# EAGLE design shield (EAGLE 7.6.0)

## Sheet 1 of 2
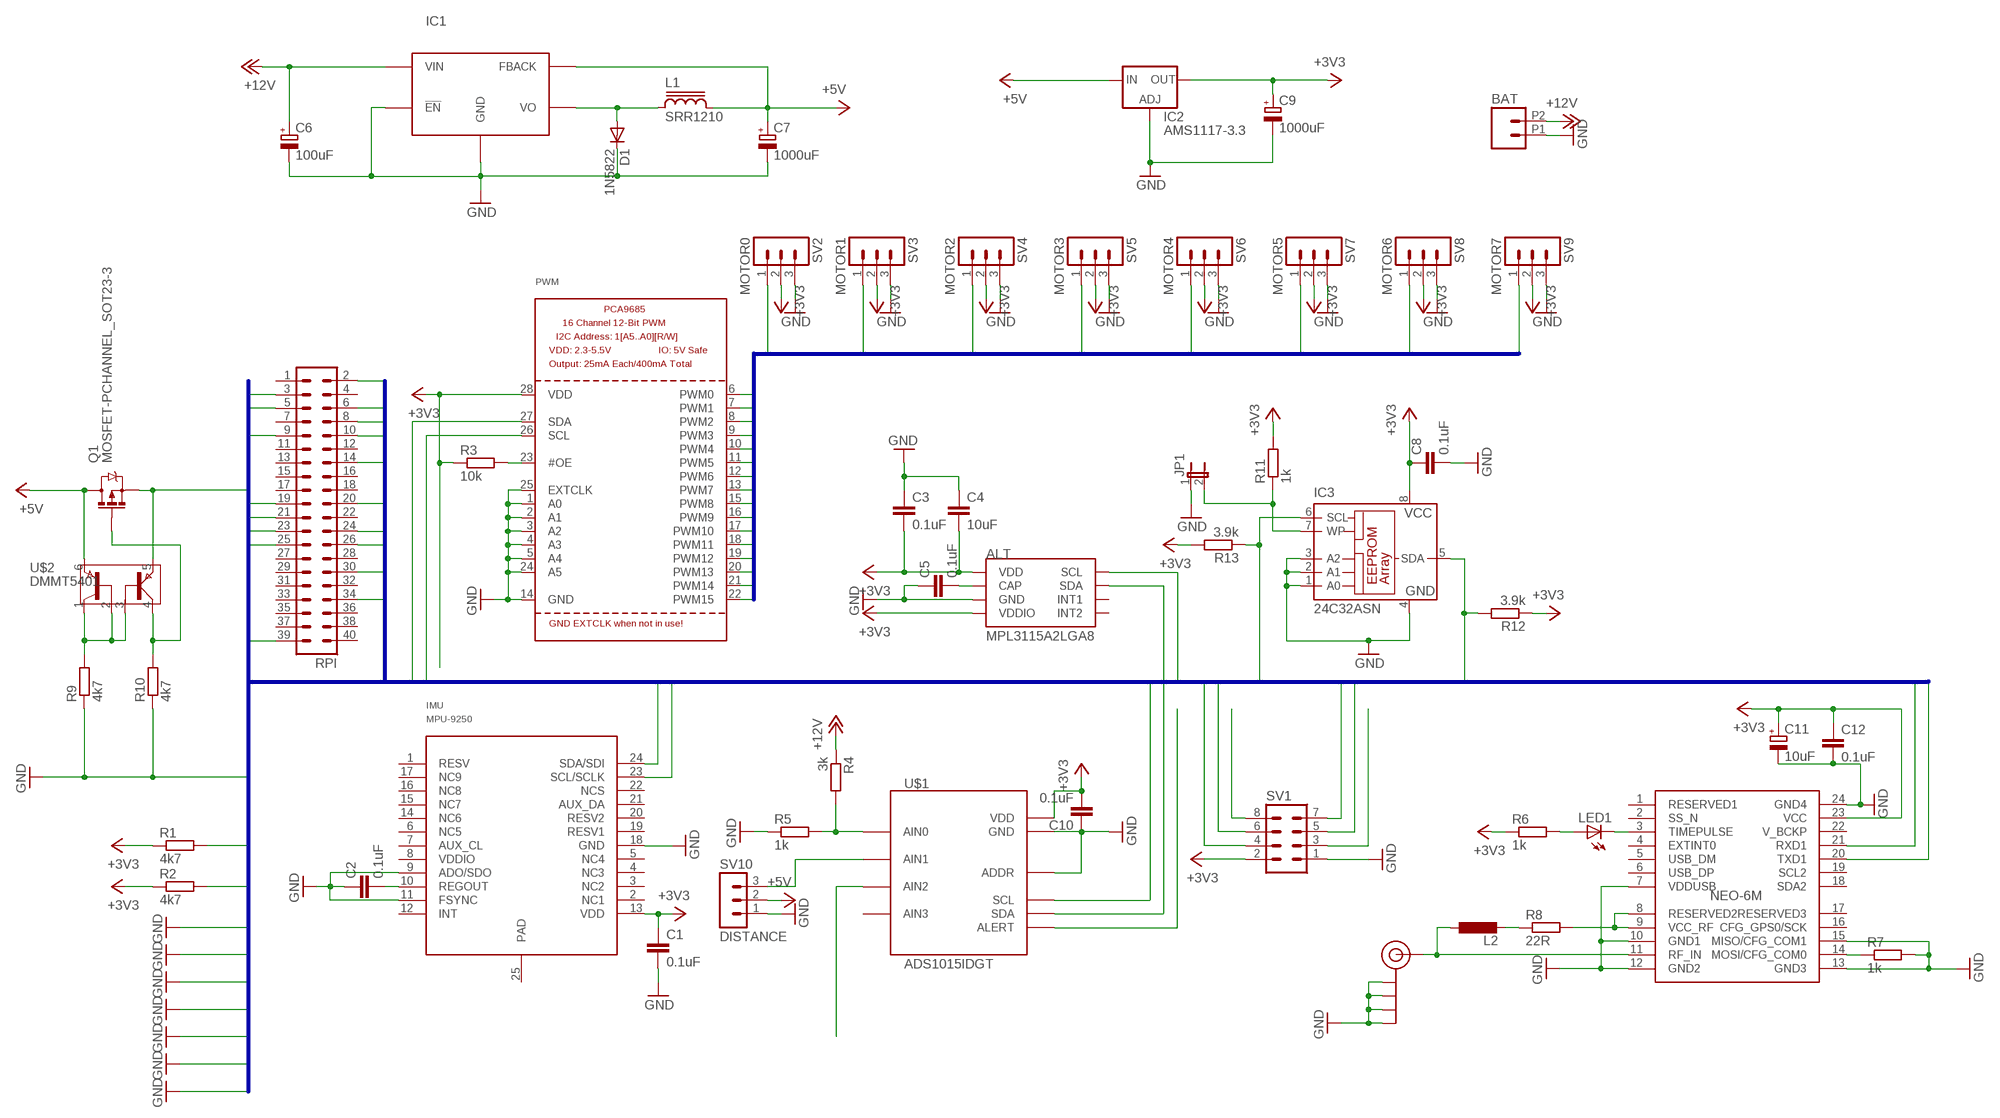
[diagram p0: schematic, sheet 1]

### Parts
ALT  MPL3115A2LGA8  [LGA8]
BAT  M022.54MM_SCREWTERM  [1X02_2.54_SCREWTERM]
C1  0.1uF  C-EUC1206  [C1206]
C2  0.1uF  C-EUC1206  [C1206]
C3  0.1uF  C-EUC1206  [C1206]
C4  10uF  C-EUC1206  [C1206]
C5  0.1uF  C-EUC1206  [C1206]
C6  100uF  CPOL-EU153CLV-0605  [153CLV-0605]
C7  1000uF  CPOL-EU153CLV-1012  [153CLV-1012]
C8  0.1uF  C-EUC1206  [C1206]
C9  1000uF  CPOL-EU153CLV-1012  [153CLV-1012]
C10  0.1uF  C-EUC1206  [C1206]
C11  10uF  CPOL-EU153CLV-0405  [153CLV-0405]
C12  0.1uF  C-EUC1206  [C1206]
D1  1N5822  DIODE-DO-214AC  [DO-214AC]
IC1  LM2576S  [TO263-5]
IC2  AMS1117-3.3  LD117AS12TR  [SOT223]
IC3  24C32ASN  [SO-08]
IMU  MPU-9250  [LEAD-QFN24]
J$1  SMA_EDGE  [SMA-EDGE]
JP1  JP1E  [JP1]
L1  SRR1210  [SRR1210]
L2  L-EUL2012C  [L2012C]
LED1  LEDSMT1206  [1206]
PWM  PCA9685  [TSSOP28]
Q1  MOSFET-PCHANNEL_SOT23-3  [SOT23-3]
R1  4k7  R-EU_R1206  [R1206]
R2  4k7  R-EU_R1206  [R1206]
R3  10k  R-EU_R1206  [R1206]
R4  3k  R-EU_R1206  [R1206]
R5  1k  R-EU_R1206  [R1206]
R6  1k  R-EU_R1206  [R1206]
R7  1k  R-EU_R1206  [R1206]
R8  22R  R-EU_R1206  [R1206]
R9  4k7  R-EU_R1206  [R1206]
R10  4k7  R-EU_R1206  [R1206]
R11  1k  R-EU_R1206  [R1206]
R12  3.9k  R-EU_R1206  [R1206]
R13  3.9k  R-EU_R1206  [R1206]
RPI  MA20-2  [MA20-2]
SV1  MA04-2  [MA04-2]
SV2  MOTOR0  MA03-1  [MA03-1]
SV3  MOTOR1  MA03-1  [MA03-1]
SV4  MOTOR2  MA03-1  [MA03-1]
SV5  MOTOR3  MA03-1  [MA03-1]
SV6  MOTOR4  MA03-1  [MA03-1]
SV7  MOTOR5  MA03-1  [MA03-1]
SV8  MOTOR6  MA03-1  [MA03-1]
SV9  MOTOR7  MA03-1  [MA03-1]
SV10  DISTANCE  MA03-1  [MA03-1]
U$1  ADS1015IDGT  [MSOP10_0.5]
U$2  DMMT5401  [SOT26]
U$6  BLOX-NEO-6M  [NE0-6M]

### Nets
+3V3: ALT.1(VDD) ALT.4(VDDIO) C1.1 C3.2 C4.2 C8.1 C9.+ C10.2 C11.+ C12.1 IC2.4(OUT) IC3.8(VCC) IMU.13(VDD) PWM.28(VDD) R1.1 R2.1 R3.1 R6.1 R11.2 R12.1 R13.2 SV1.2 SV2.2 SV3.2 SV4.2 SV5.2 SV6.2 SV7.2 SV8.2 SV9.2 U$1.8(VDD) U$6.23(VCC)
+5V: C7.+ IC1.4(FBACK) IC2.3(IN) L1.2 Q1.3(D) SV10.2 U$2.6
+12V: BAT.P2 C6.+ IC1.1(VIN) R4.1
GND: ALT.3(GND) BAT.P1 C1.2 C2.1 C3.1 C4.1 C5.1 C6.- C7.- C8.2 C9.- C10.1 C11.- C12.2 D1.C IC1.3(GND) IC1.5(!EN) IC1.TAB(GND) IC2.1(ADJ) IC3.1(A0) IC3.2(A1) IC3.3(A2) IC3.4(GND) IMU.9(ADO/SDO) IMU.11(FSYNC) IMU.18(GND) J$1.GND@0(GND) J$1.GND@1(GND) J$1.GND@2(GND) J$1.GND@3(GND) JP1.1 PWM.1(A0) PWM.2(A1) PWM.3(A2) PWM.4(A3) PWM.5(A4) PWM.14(GND) PWM.24(A5) PWM.25(EXTCLK) R5.1 R7.2 R9.1 R10.1 RPI.6 RPI.9 RPI.14 RPI.20 RPI.25 RPI.30 RPI.34 RPI.39 SV1.1 SV2.3 SV3.3 SV4.3 SV5.3 SV6.3 SV7.3 SV8.3 SV9.3 SV10.1 U$1.1(ADDR) U$1.3(GND) U$6.7(VDDUSB) U$6.10(GND1) U$6.12(GND2) U$6.13(GND3) U$6.15(MISO/CFG_COM1) U$6.24(GND4)
N$1: C2.2 IMU.10(REGOUT)
N$2: PWM.23(#OE) R3.2
N$3: ALT.2(CAP) C5.2
N$4: R4.2 R5.2 U$1.4(AIN0)
N$5: SV10.3 U$1.5(AIN1)
N$6: U$1.6(AIN2)
N$7: D1.A IC1.2(VO) L1.1
N$8: LED1.A R6.2
N$9: U$1.2(ALERT)
N$10: LED1.C U$6.3(TIMEPULSE)
N$11: R7.1 U$6.14(MOSI/CFG_COM0)
N$12: SV1.3
N$13: R8.2 U$6.8(RESERVED2) U$6.9(VCC_RF)
N$14: L2.2 R8.1
N$15: J$1.SIG(SIGNAL) L2.1 U$6.11(RF_IN)
N$16: R9.2 U$2.1 U$2.2 U$2.3
N$17: Q1.1(G) R10.2 U$2.4
N$18: SV1.8
N$21: IC3.7(WP) JP1.2 R11.1
PWM0: PWM.6(PWM0) SV2.1
PWM1: PWM.7(PWM1) SV3.1
PWM2: PWM.8(PWM2) SV4.1
PWM3: PWM.9(PWM3) SV5.1
PWM4: PWM.10(PWM4) SV6.1
PWM5: PWM.11(PWM5) SV7.1
PWM6: PWM.12(PWM6) SV8.1
PWM7: PWM.13(PWM7) SV9.1
PWM8: PWM.15(PWM8)
PWM9: PWM.16(PWM9)
PWM10: PWM.17(PWM10)
PWM11: PWM.18(PWM11)
PWM12: PWM.19(PWM12)
PWM13: PWM.20(PWM13)
PWM14: PWM.21(PWM14)
PWM15: PWM.22(PWM15)
RPI2: Q1.2(S) RPI.2 U$2.5
RPI3: ALT.7(SDA) IMU.24(SDA/SDI) PWM.27(SDA) R1.2 RPI.3 U$1.9(SDA)
RPI5: ALT.8(SCL) IMU.23(SCL/SCLK) PWM.26(SCL) R2.2 RPI.5 U$1.10(SCL)
RPI8: RPI.8 U$6.21(RXD1)
RPI10: RPI.10 U$6.20(TXD1)
RPI19: RPI.19 SV1.6
RPI21: RPI.21 SV1.7
RPI23: RPI.23 SV1.5
RPI24: RPI.24 SV1.4
RPI26: RPI.26
RPI27: IC3.5(SDA) R12.2
RPI28: IC3.6(SCL) R13.1
Unconnected: ALT.5(INT2) ALT.6(INT1) IMU.1(RESV) IMU.2(NC1) IMU.3(NC2) IMU.4(NC3) IMU.5(NC4) IMU.6(NC5) IMU.7(AUX_CL) IMU.8(VDDIO) IMU.12(INT) IMU.14(NC6) IMU.15(NC7) IMU.16(NC8) IMU.17(NC9) IMU.19(RESV1) IMU.20(RESV2) IMU.21(AUX_DA) IMU.22(NCS) IMU.25(PAD) RPI.1 RPI.4 RPI.7 RPI.11 RPI.12 RPI.13 RPI.15 RPI.16 RPI.17 RPI.18 RPI.22 RPI.27 RPI.28 RPI.29 RPI.31 RPI.32 RPI.33 RPI.35 RPI.36 RPI.37 RPI.38 RPI.40 U$1.7(AIN3) U$6.1(RESERVED1) U$6.2(SS_N) U$6.4(EXTINT0) U$6.5(USB_DM) U$6.6(USB_DP) U$6.16(CFG_GPS0/SCK) U$6.17(RESERVED3) U$6.18(SDA2) U$6.19(SCL2) U$6.22(V_BCKP)

### Buses
RPI[1..40]
PWM[0..15]

## Sheet 2 of 2

## Library data of the parts
ALT = SparkFun-Sensors:MPL3115A2: Altimeter/Pressure Sensor, I2C, 1.95V-3.6V supply, 50 to 110kPa; PROD_ID: IC-10869
BAT = SparkFun-Connectors:M02: Standard 2-pin 0.1" header. Use with - straight break away headers ( PRT-00116) - right angle break away headers (PRT-00553) - swiss pins (PRT-00743) - machine pins (PRT-00117) - female headers (PRT-00115) Molex polarized connector foot print use with: PRT-08233 with associated crimp pins and housings. 2.54_SCREWTERM for use with PRT-10571. 3.5mm Screw Terminal footprints for PRT-08084 5mm Screw Terminal footprints for use with PRT-08432
C1-C5 C8 C10 C12 = rcl:C-EU: CAPACITOR, European symbol
C6 C7 C9 C11 = rcl:CPOL-EU: POLARIZED CAPACITOR, European symbol
D1 = diode:DIODE-: DIODE
IC1 = AWJLEagleLib:LM2576: Texas Instruments LM2576 Simple Switcher
IC2 = v-reg:LD117A?*: Low drop fixed and adjustable positive voltage regulators 1 A Source: http://www.st.com/stonline/products/literature/ds/7194/ld1117axx.pdf
IC3 = microchip:24*: Serial EEPROM I2C; MPN: IS24C32A-2GLI; OC_FARNELL: 1224413; OC_NEWARK: 43M4588
IMU = invensense:MPU-9250
J$1 = SparkFun-Connectors:SMA_EDGE: SMA Antenna Connector End launch SMA connector. The paste layer has been removed so that the connector can be hand soldered onto the board after reflow.
JP1 = jumper:JP1E: JUMPER
L1 = inductor-bourns:SRR1210: POWER INDUCTOR
L2 = rcl:L-EU: INDUCTOR, European symbol
LED1 = led:LED: LED OSRAM: - CHIPLED LG R971, LG N971, LY N971, LG Q971, LY Q971, LO R971, LY R971 LH N974, LH R974 LS Q976, LO Q976, LY Q976 LO Q996 - Hyper CHIPLED LW Q18S LB Q993, LB Q99A, LB R99A - SideLED LS A670, LO A670, LY A670, LG A670, LP A670 LB A673, LV A673, LT A673, LW A673 LH A674 LY A675 LS A676, LA A676, LO A676, LY A676, LW A676 LS A679, LY A679, LG A679 - Hyper Micro SIDELED® LS Y876, LA Y876, LO Y876, LY Y876 LT Y87S - SmartLED LW L88C, LW L88S LB L89C, LB L89S, LG L890 LS L89K, LO L89K, LY L89K LS L896, LA L896, LO L896, LY L896 - TOPLED LS T670, LO T670, LY T670, LG T670, LP T670 LSG T670, LSP T670, LSY T670, LOP T670, LYG T670 LG T671, LOG T671, LSG T671 LB T673, LV T673, LT T673, LW T673 LH T674 LS T676, LA T676, LO T676, LY T676, LB T676, LH T676, LSB T676, LW T676 LB T67C, LV T67C, LT T67C, LS T67K, LO T67K, LY T67K, LW E67C LS E67B, LA E67B, LO E67B, LY E67B, LB E67C, LV E67C, LT E67C LW T67C LS T679, LY T679, LG T679 LS T770, LO T770, LY T770, LG T770, LP T770 LB T773, LV T773, LT T773, LW T773 LH T774 LS E675, LA E675, LY E675, LS T675 LS T776, LA T776, LO T776, LY T776, LB T776 LHGB T686 LT T68C, LB T68C - Hyper Mini TOPLED® LB M676 - Mini TOPLED Santana® LG M470 LS M47K, LO M47K, LY M47K Source: http://www.osram.convergy.de LUXEON: - LUMILED® LXK2-PW12-R00, LXK2-PW12-S00, LXK2-PW14-U00, LXK2-PW14-V00 LXK2-PM12-R00, LXK2-PM12-S00, LXK2-PM14-U00 LXK2-PE12-Q00, LXK2-PE12-R00, LXK2-PE12-S00, LXK2-PE14-T00, LXK2-PE14-U00 LXK2-PB12-K00, LXK2-PB12-L00, LXK2-PB12-M00, LXK2-PB14-N00, LXK2-PB14-P00, LXK2-PB14-Q00 LXK2-PR12-L00, LXK2-PR12-M00, LXK2-PR14-Q00, LXK2-PR14-R00 LXK2-PD12-Q00, LXK2-PD12-R00, LXK2-PD12-S00 LXK2-PH12-R00, LXK2-PH12-S00 LXK2-PL12-P00, LXK2-PL12-Q00, LXK2-PL12-R00 Source: www.luxeon.com KINGBRIGHT: KA-3528ASYC Source: www.kingbright.com
PWM = adafruit:PCA9685: PCA9685 - 16 Channel 12-Bit I2C PWM Controller 5.0V tolerant 16 channel, 12-bit I2C PWM controller with 25mA per output (max. 400mA total) Digikey: 568-5931-1-ND
Q1 = Simplex-DiscreteSemi:MOSFET-PCHANNEL: Generic P-channel mosfet
R1-R13 = resistor:R-EU_: RESISTOR, European symbol
RPI = con-lstb:MA20-2: PIN HEADER; OC_FARNELL: unknown; OC_NEWARK: unknown
SV1 = con-lstb:MA04-2: PIN HEADER; OC_FARNELL: unknown; OC_NEWARK: unknown
SV2-SV10 = con-lstb:MA03-1: PIN HEADER; OC_FARNELL: unknown; OC_NEWARK: unknown
U$1 = bt_adc:ADS1015: Ti ADS1015 12-bit ADC Ultra-Small, Low-Power, 12-Bit Analog-to-Digital Converter with Internal Reference The ADS1013, ADS1014, and ADS1015 are precision analog-to-digital converters (ADCs) with 12 bits of resolution offered in an ultra-small, leadless QFN-10 package or an MSOP-10 package. \ Source: http://focus.ti.com/docs/prod/folders/print/ads1015.html
U$2 = Erle:DMMT5401
U$6 = microduino:BLOX-NEO-6M

## Board
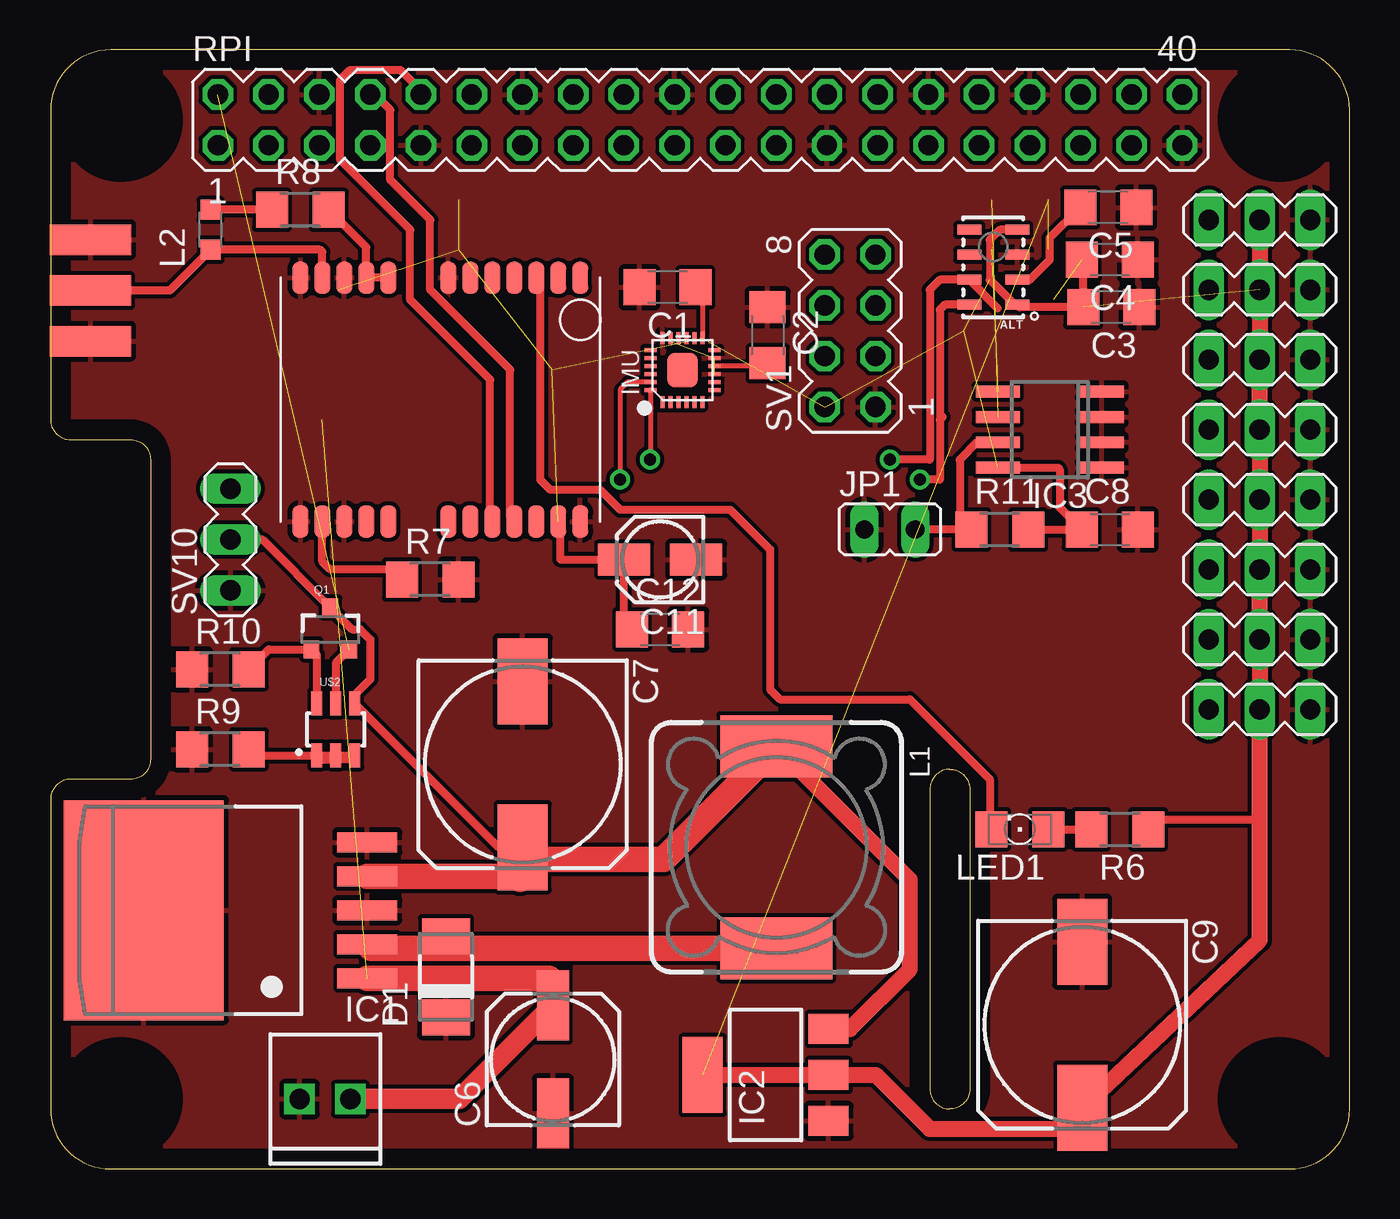
[diagram p1: board, top side]
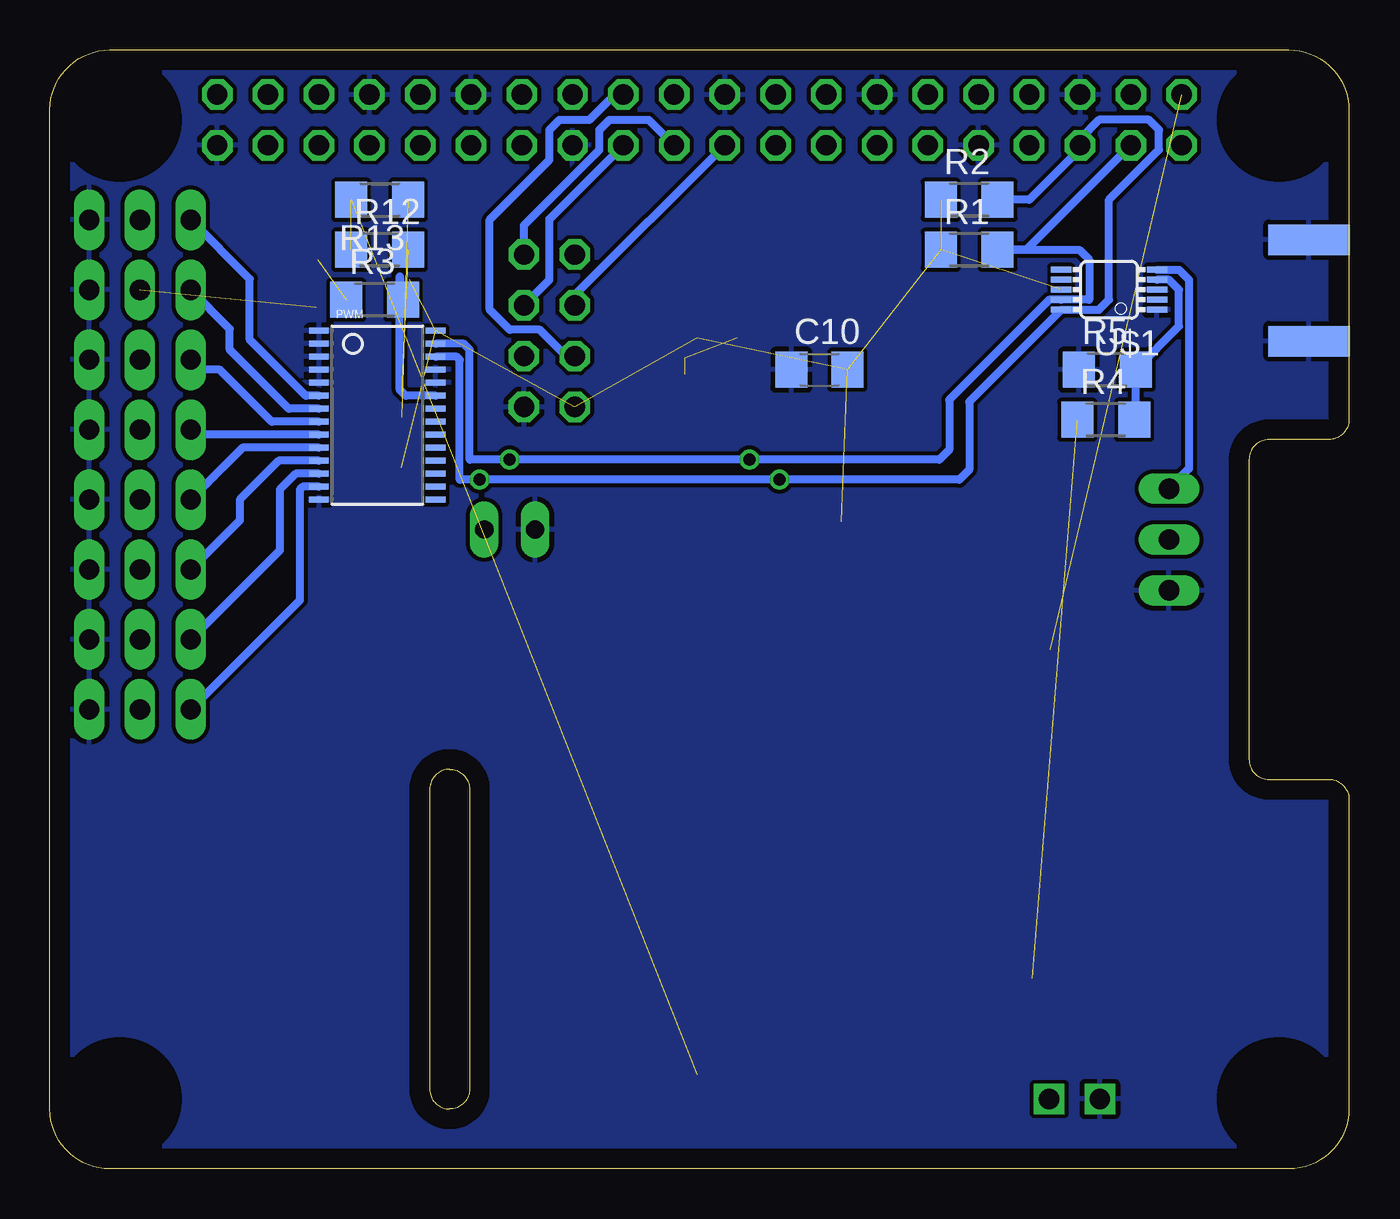
[diagram p2: board, bottom side, seen from below]

Size 65 x 56 mm. Coordinates in mm from the lower left corner, seen from the top.
Outline: 0,3 arc90 3,0 62,0 arc90 65,3 65,53 arc90 62,56 3,56 arc90 0,53 0,37.5 arc90 1,36.5 4,36.5 arc-90 5,35.5 5,20.5 arc-90 4,19.5 1,19.5 arc90 0,18.5 0,3
Outline: 44,19 44,4 arc90 45,3 arc90 46,4 46,19 arc90 45,20 arc90 44,19
Copper layers (1*16): Top 0.035mm / dielectric 1.5mm / Bottom 0.035mm
Design rules "default": minimum track width 10mil, minimum drill 24mil, track to track 8mil, track to pad 8mil, pad to pad 8mil, via to via 8mil, smd to smd 8mil, copper to edge 40mil, drill to drill 8mil, minimum pad ring 10mil, minimum via ring 8mil, stop-mask expansion 4mil, vias tented up to drill 0mil, thermal gap 10mil
tRestrict: area 1.9,51 to 5,54; area 60,51 to 63,54; area 60,1.9 to 63,5; area 1.9,1.9 to 5,5
bRestrict: area 1.9,1.9 to 5,5; area 1.9,51 to 5,54; area 60,1.9 to 63,5; area 60,51 to 63,54

### Footprints (pad centres in the part's own frame; a part is rotated, then mirrored left to right if it is on the bottom)
LGA8 = smd 1.2 x 0.5: 1 -1.2,1.875; 2 -1.2,0.625; 3 -1.2,-0.625; 4 -1.2,-1.875; 5 1.2,-1.875; 6 1.2,-0.625; 7 1.2,0.625; 8 1.2,1.875
1X02_2.54_SCREWTERM = drill 1.016 square: P1 2.54,0; P2 0,0
C1206 = smd 1.6 x 1.8: 1 -1.4,0; 2 1.4,0
153CLV-0605 = smd 3.5 x 1.6: + 2.7,0; - -2.7,0
153CLV-1012 = smd 4.3 x 2.5: + 4.15,0; - -4.15,0
153CLV-0405 = smd 2.6 x 1.6: + 1.8,0; - -1.8,0
DO-214AC = smd 1.8 x 2.4: A 2.025,0; C -2.025,0
TO263-5 = smd 1 x 3: 1 -3.4,-8; 2 -1.7,-8; 3 0,-8; 4 1.7,-8; 5 3.4,-8 | smd 11 x 8: TAB 0,3.175
SOT223 = smd 1.5 x 2: 1 -2.3,-3.15; 2 0,-3.15; 3 2.3,-3.15 | smd 3.8 x 2: 4 0,3.15
SO-08 = smd 0.6 x 2.2: 1 -1.905,-2.6; 2 -0.635,-2.6; 3 0.635,-2.6; 4 1.905,-2.6; 5 1.905,2.6; 6 0.635,2.6; 7 -0.635,2.6; 8 -1.905,2.6
LEAD-QFN24 = smd 0.6 x 0.2: 1 -1.6,1; 2 -1.6,0.6; 3 -1.6,0.2; 4 -1.6,-0.2; 5 -1.6,-0.6; 6 -1.6,-1; 13 1.6,-1; 14 1.6,-0.6; 15 1.6,-0.2; 16 1.6,0.2; 17 1.6,0.6; 18 1.6,1 | smd 0.2 x 0.6: 7 -1,-1.6; 8 -0.6,-1.6; 9 -0.2,-1.6; 10 0.2,-1.6; 11 0.6,-1.6; 12 1,-1.6; 19 1,1.6; 20 0.6,1.6; 21 0.2,1.6; 22 -0.2,1.6; 23 -0.6,1.6; 24 -1,1.6 | smd 1.7 x 1.54: 25 0,0
SMA-EDGE = smd 1.524 x 4.064: GND@0 0,0; GND@1 5.08,0; SIG 2.54,0 | smd 1.524 x 4.064 bottom: GND@2 0,0; GND@3 5.08,0
JP1 = drill 0.914 long: 1 0,-1.27; 2 0,1.27
SRR1210 = smd 5.6 x 3.1: 1 0,5.05; 2 0,-5.05
L2012C = smd 1 x 1: 1 -1,0; 2 1,0
1206 = smd 1.6 x 1.803: A -1.422,0; C 1.422,0
TSSOP28 = smd 0.305 x 0.991: 1 -4.225,-2.918; 2 -3.575,-2.918; 3 -2.925,-2.918; 4 -2.275,-2.918; 5 -1.625,-2.918; 6 -0.975,-2.918; 7 -0.325,-2.918; 8 0.325,-2.918; 9 0.975,-2.918; 10 1.625,-2.918; 11 2.275,-2.918; 12 2.925,-2.918; 13 3.575,-2.918; 14 4.225,-2.918; 15 4.225,2.918; 16 3.575,2.918; 17 2.925,2.918; 18 2.275,2.918; 19 1.625,2.918; 20 0.975,2.918; 21 0.325,2.918; 22 -0.325,2.918; 23 -0.975,2.918; 24 -1.625,2.918; 25 -2.275,2.918; 26 -2.925,2.918; 27 -3.575,2.918; 28 -4.225,2.918
SOT23-3 = smd 0.8 x 0.9: 1 -0.95,-1; 2 0.95,-1; 3 0,1.1
R1206 = smd 1.6 x 1.803: 1 -1.422,0; 2 1.422,0
MA20-2 = drill 1.016 octagon: 1 -24.13,-1.27; 2 -24.13,1.27; 3 -21.59,-1.27; 4 -21.59,1.27; 5 -19.05,-1.27; 6 -19.05,1.27; 7 -16.51,-1.27; 8 -16.51,1.27; 9 -13.97,-1.27; 10 -13.97,1.27; 11 -11.43,-1.27; 12 -11.43,1.27; 13 -8.89,-1.27; 14 -8.89,1.27; 15 -6.35,-1.27; 16 -6.35,1.27; 17 -3.81,-1.27; 18 -3.81,1.27; 19 -1.27,-1.27; 20 -1.27,1.27; 21 1.27,-1.27; 22 1.27,1.27; 23 3.81,-1.27; 24 3.81,1.27; 25 6.35,-1.27; 26 6.35,1.27; 27 8.89,-1.27; 28 8.89,1.27; 29 11.43,-1.27; 30 11.43,1.27; 31 13.97,-1.27; 32 13.97,1.27; 33 16.51,-1.27; 34 16.51,1.27; 35 19.05,-1.27; 36 19.05,1.27; 37 21.59,-1.27; 38 21.59,1.27; 39 24.13,-1.27; 40 24.13,1.27
MA04-2 = drill 1.016 octagon: 1 -3.81,-1.27; 2 -3.81,1.27; 3 -1.27,-1.27; 4 -1.27,1.27; 5 1.27,-1.27; 6 1.27,1.27; 7 3.81,-1.27; 8 3.81,1.27
MA03-1 = drill 1.016 long: 1 -2.54,0; 2 0,0; 3 2.54,0
MSOP10_0.5 = smd 0.3 x 1.02: 1 -1,-2.4; 2 -0.5,-2.4; 3 0,-2.4; 4 0.5,-2.4; 5 1,-2.4; 6 1,2.4; 7 0.5,2.4; 8 0,2.4; 9 -0.5,2.4; 10 -1,2.4
SOT26 = smd 0.55 x 1.2: 1 2.22,-1.3; 2 1.27,-1.3; 3 0.32,-1.3; 4 0.32,1.3; 5 1.27,1.3; 6 2.22,1.3
NE0-6M = smd 1.6 x 0.8: 1 -6.1,14; 2 -6.1,12.9; 3 -6.1,11.8; 4 -6.1,10.7; 5 -6.1,9.6; 6 -6.1,8.5; 7 -6.1,7.4; 8 -6.1,4.4; 9 -6.1,3.3; 10 -6.1,2.2; 11 -6.1,1.1; 12 -6.1,0; 13 6.1,0; 14 6.1,1.1; 15 6.1,2.2; 16 6.1,3.3; 17 6.1,4.4; 18 6.1,7.4; 19 6.1,8.5; 20 6.1,9.6; 21 6.1,10.7; 22 6.1,11.8; 23 6.1,12.9; 24 6.1,14

### Placement (x,y rotation side)
ALT  47.17,45.12 180 top
BAT  15,3.5 180 top
C1  30.87,44.12 180 top
C2  35.88,41.72 270 top
C3  53.07,43.12 180 top
C4  53.01,45.5 180 top
C5  52.92,48.12 180 top
C6  25.14,5.48 90 top
C7  23.62,20.25 270 top
C8  53,32 0 top
C9  51.62,7.22 270 top
C10  26.5,40 0 bottom
C11  30.5,30.5 180 top
C12  30.5,27 0 top
D1  19.78,9.62 90 top
IC1  7.84,12.95 90 top
IC2  35.78,4.71 90 top
IC3  50,37 90 top
IMU  31.62,39.98 90 top
J$1  2,46.5 270 top
JP1  42,32 270 top
L1  36.32,16.1 180 top
L2  8,47 90 top
LED1  48.5,17 180 top
PWM  48.62,37.72 270 bottom
Q1  14,27 0 top
R1  19,46 0 bottom
R2  19,48.5 0 bottom
R3  48.75,43.5 0 bottom
R4  12.17,37.5 0 bottom
R5  12.09,40 0 bottom
R6  53.5,17 180 top
R7  19,29.5 0 top
R8  12.5,48 0 top
R9  8.5,21 0 top
R10  8.5,25 0 top
R11  47.5,32 0 top
R12  48.5,46 0 bottom
R13  48.5,48.5 180 bottom
RPI  32.5,52.5 0 top
SV1  40.01,41.95 90 top
SV2  60.5,47.5 0 top
SV3  60.5,44 0 top
SV4  60.5,40.5 0 top
SV5  60.5,37 0 top
SV6  60.5,33.5 0 top
SV7  60.5,30 0 top
SV8  60.5,26.5 0 top
SV9  60.5,23 0 top
SV10  9,31.5 90 top
U$1  12,44 90 bottom
U$2  13,22 0 top
U$6  12.5,38.5 270 top

### Tracks (layer width: path | path; a pad name or v marks a point on that pad's centre or on a via)
+3V3  (13 unrouted)
  Top 0.254: C1.1 32.62,43.77 IMU.13
  Top 0.406: C12.1 28.7,27.4 C11.+ 25.5,30.5 25.5,32.3 U$6.23 | R6.1 55.42,17.5 60.5,17.5 | C4.2 51.67,45.44 C3.2 48.49,43.12 ALT.1 48.26,43.24 47,44.5 47,46.5 47.49,46.99 ALT.4 | IC3.8 50.41,35.09 50.5,35 50.5,33.1 C8.1 R11.2
  Top 0.813: IC2.4 41.29,4.71 44,2 51.05,2 C9.+ 60.5,11.45 SV9.2 | SV2.2 SV3.2 SV4.2 SV5.2 SV6.2 SV7.2 SV8.2 SV9.2 | 60.5,17.5 SV9.2
+5V
  Top 0.406: C7.+ 22.42,16.1 U$2.6 15.22,23.72 16,24.5 16,26.5 15.5,27 15.1,27 Q1.3 10.6,31.5 SV10.2
  Top 0.813: IC2.3 40.01,7.01 43,10 43,14.47 L1.2
  Top 1.27: IC1.4 23.35,14.65 23.5,14.5 23.5,15.5 | 23.5,15.5 23.5,15.98 C7.+ | L1.2 30.67,15.5 23.5,15.5
+12V  (1 unrouted)
  Top 1.016: BAT.P2 20.46,3.5 C6.+
  Top 1.27: IC1.1 24.95,9.55 25,9.5 25,8.32 C6.+
GND  (2 unrouted)
  pour Bottom: 0,3 arc90 3,0 62,0 arc90 65,3 65,53 arc90 62,56 3,56 arc90 0,53 0,37.5 arc90 1,36.5 4,36.5 arc-90 5,35.5 5,20.5 arc-90 4,19.5 1,19.5 arc90 0,18.5
  pour Top: 0,3 arc90 3,0 62,0 arc90 65,3 65,53 arc90 62,56 3,56 arc90 0,53 0,37.5 arc90 1,36.5 4,36.5 arc-90 5,35.5 5,20.5 arc-90 4,19.5 1,19.5 arc90 0,18.5
N$1
  Top 0.254: C2.2 35.74,40.18 IMU.10
N$2
  Bottom 0.406: PWM.23 47.2,38.7 47.5,39 47.5,44.67 R3.2
N$3
  Top 0.406: ALT.2 48.99,44.49 50,45.5 50,46.6 C5.2
N$4
  Bottom 0.406: R4.2 10.67,37.58 R5.2 8.5,42.17 8.5,44 9,44.5 U$1.4
N$5
  Bottom 0.406: U$1.5 8.5,45 8,44.5 8,35.04 SV10.3
N$7
  Top 0.813: 16.04,11.05 IC1.2 | D1.A 19.09,11.14 19,11.05
  Top 1.27: L1.1 19,11.05 16.04,11.05
N$8
  Top 0.406: LED1.A R6.2
N$10
  Top 0.406: U$6.3 24.5,44.4 24.5,34.5 25,34 27.5,34 28.5,33 34,33 36,31 36,24 36.5,23.5 43,23.5 47,19.5 47,17.08 LED1.C
N$11
  Top 0.406: R7.1 17.08,30 14,30 13.6,30.4 U$6.14
N$13
  Top 0.406: U$6.8 U$6.9 15.8,46.12 R8.2
N$14
  Top 0.406: R8.1 L2.2
N$15
  Top 0.406: U$6.11 13.6,45.9 13.5,46 L2.1 5.96,43.96 J$1.SIG
N$16
  Top 0.406: R9.2 10.22,20.7 U$2.3 U$2.2 U$2.1 15.02,20.5 14,20.5 13.5,20.5
N$17
  Top 0.406: R10.2 10.92,26 Q1.1 13.32,25.73 U$2.4
N$21
  Top 0.406: IC3.7 46.37,36.37 45.5,35.5 45.5,32.58 R11.1 JP1.2
PWM0
  Bottom 0.406: PWM.6 52.2,38.7 55,41.5 55,44.54 SV2.1
PWM1
  Bottom 0.406: PWM.7 53.05,38.05 56,41 56,42.04 SV3.1
PWM2
  Bottom 0.406: PWM.8 53.9,37.4 56.5,40 57.46,40 SV4.1
PWM3
  Bottom 0.406: PWM.9 57.7,36.74 SV5.1
PWM4
  Bottom 0.406: PWM.10 55.37,36.09 SV6.1
PWM5
  Bottom 0.406: PWM.11 53.55,35.45 55.5,33.5 55.5,32.46 SV7.1
PWM6
  Bottom 0.406: PWM.12 52.7,34.8 53.5,34 53.5,30.96 SV8.1
PWM7
  Bottom 0.406: PWM.13 52.35,34.15 52.5,34 52.5,28.46 SV9.1
RPI2  (1 unrouted)
  Top 0.406: Q1.2 14.27,25.32 U$2.5
RPI3  (via drill 0.6)
  Top 0.254: IMU.24 30.02,35.52 v30,35.5
  Top 0.406: v42,35.5 44,35.5 44,44 44.49,44.49 ALT.7 47.4,43.06
  Bottom 0.406: PWM.27 44.3,41.3 44,41 44,35.5 v42,35.5 v30,35.5 20.5,35.5 20,36 20,38.5 15,43.5 U$1.9 13,43.5 13,45.5 13.5,46 R1.2 16.14,46 RPI.3
RPI5  (via drill 0.6)
  Top 0.254: IMU.23 28.88,39.38 28.5,39 v28.5,34.5
  Top 0.406: ALT.8 44.74,43.24 44.5,43 44.5,37.5 | 44.5,37.5 44.5,34.5 v43.5,34.5 | 44.63,37.63 44.5,37.5
  Bottom 0.406: PWM.26 44.65,40.65 44.5,40.5 44.5,34.5 v43.5,34.5 v28.5,34.5 19.5,34.5 19,35 19,38.4 U$1.10 12.5,43 12,43.5 12,48.5 9.5,51 9.5,52 10,52.5 12.5,52.5 13.45,51.55 RPI.5 13.45,51.05 16,48.5 R2.2
RPI8
  Top 0.406: U$6.21 23,32.6 23,40 19,44 19,47.5 17,49.5 17,53 16.23,53.77 RPI.8
RPI10
  Top 0.406: U$6.20 22,32.5 22,39.5 18,43.5 18,47 14.5,50.5 14.5,54.5 15,55 17.5,55 18.53,53.97 RPI.10
RPI19
  Bottom 0.406: SV1.6 38.74,43.72 RPI.19
RPI21
  Bottom 0.406: SV1.7 41.28,47.22 37.5,51 37.5,52 37,52.5 35.04,52.5 RPI.21
RPI23
  Bottom 0.406: SV1.5 40,44.5 40,47.54 RPI.23
RPI24
  Bottom 0.406: SV1.4 39.18,40.68 40.5,42 42,42 43,43 43,47.5 40,50.5 40,52 39.5,52.5 38,52.5 37,53.5 36.58,53.5 RPI.24
RPI27  (1 unrouted)
RPI28  (1 unrouted)